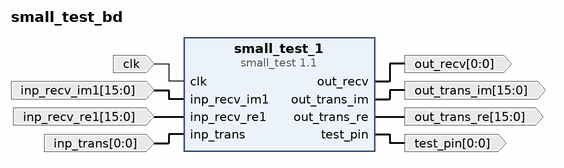
[diagram p0: block diagram of the top level]
# Vivado block design small_test_bd, Vivado 2014.4
create_bd_design small_test_bd

create_bd_port -dir I -type clk clk
create_bd_port -dir I -from 15 -to 0 -type data inp_recv_im1
create_bd_port -dir I -from 15 -to 0 -type data inp_recv_re1
create_bd_port -dir I -from 0 -to 0 -type data inp_trans
create_bd_port -dir O -from 0 -to 0 -type data out_recv
create_bd_port -dir O -from 15 -to 0 -type data out_trans_im
create_bd_port -dir O -from 15 -to 0 -type data out_trans_re
create_bd_port -dir O -from 0 -to 0 -type data test_pin

create_bd_cell -type ip -vlnv User_Company:SysGen:small_test:1.1 small_test_1

# ---- connections ----

connect_bd_net [get_bd_ports clk] [get_bd_pins small_test_1/clk]
connect_bd_net -net inp_recv_im1_1 [get_bd_ports inp_recv_im1] [get_bd_pins small_test_1/inp_recv_im1]
connect_bd_net -net inp_recv_re1_1 [get_bd_ports inp_recv_re1] [get_bd_pins small_test_1/inp_recv_re1]
connect_bd_net [get_bd_ports inp_trans] [get_bd_pins small_test_1/inp_trans]
connect_bd_net [get_bd_pins small_test_1/out_recv] [get_bd_ports out_recv]
connect_bd_net [get_bd_pins small_test_1/out_trans_im] [get_bd_ports out_trans_im]
connect_bd_net [get_bd_pins small_test_1/out_trans_re] [get_bd_ports out_trans_re]
connect_bd_net [get_bd_pins small_test_1/test_pin] [get_bd_ports test_pin]

validate_bd_design
save_bd_design
